# Altium schematic sheet [03] - 28PINS SCHEMATIC.SchDoc (part 3 of 3)
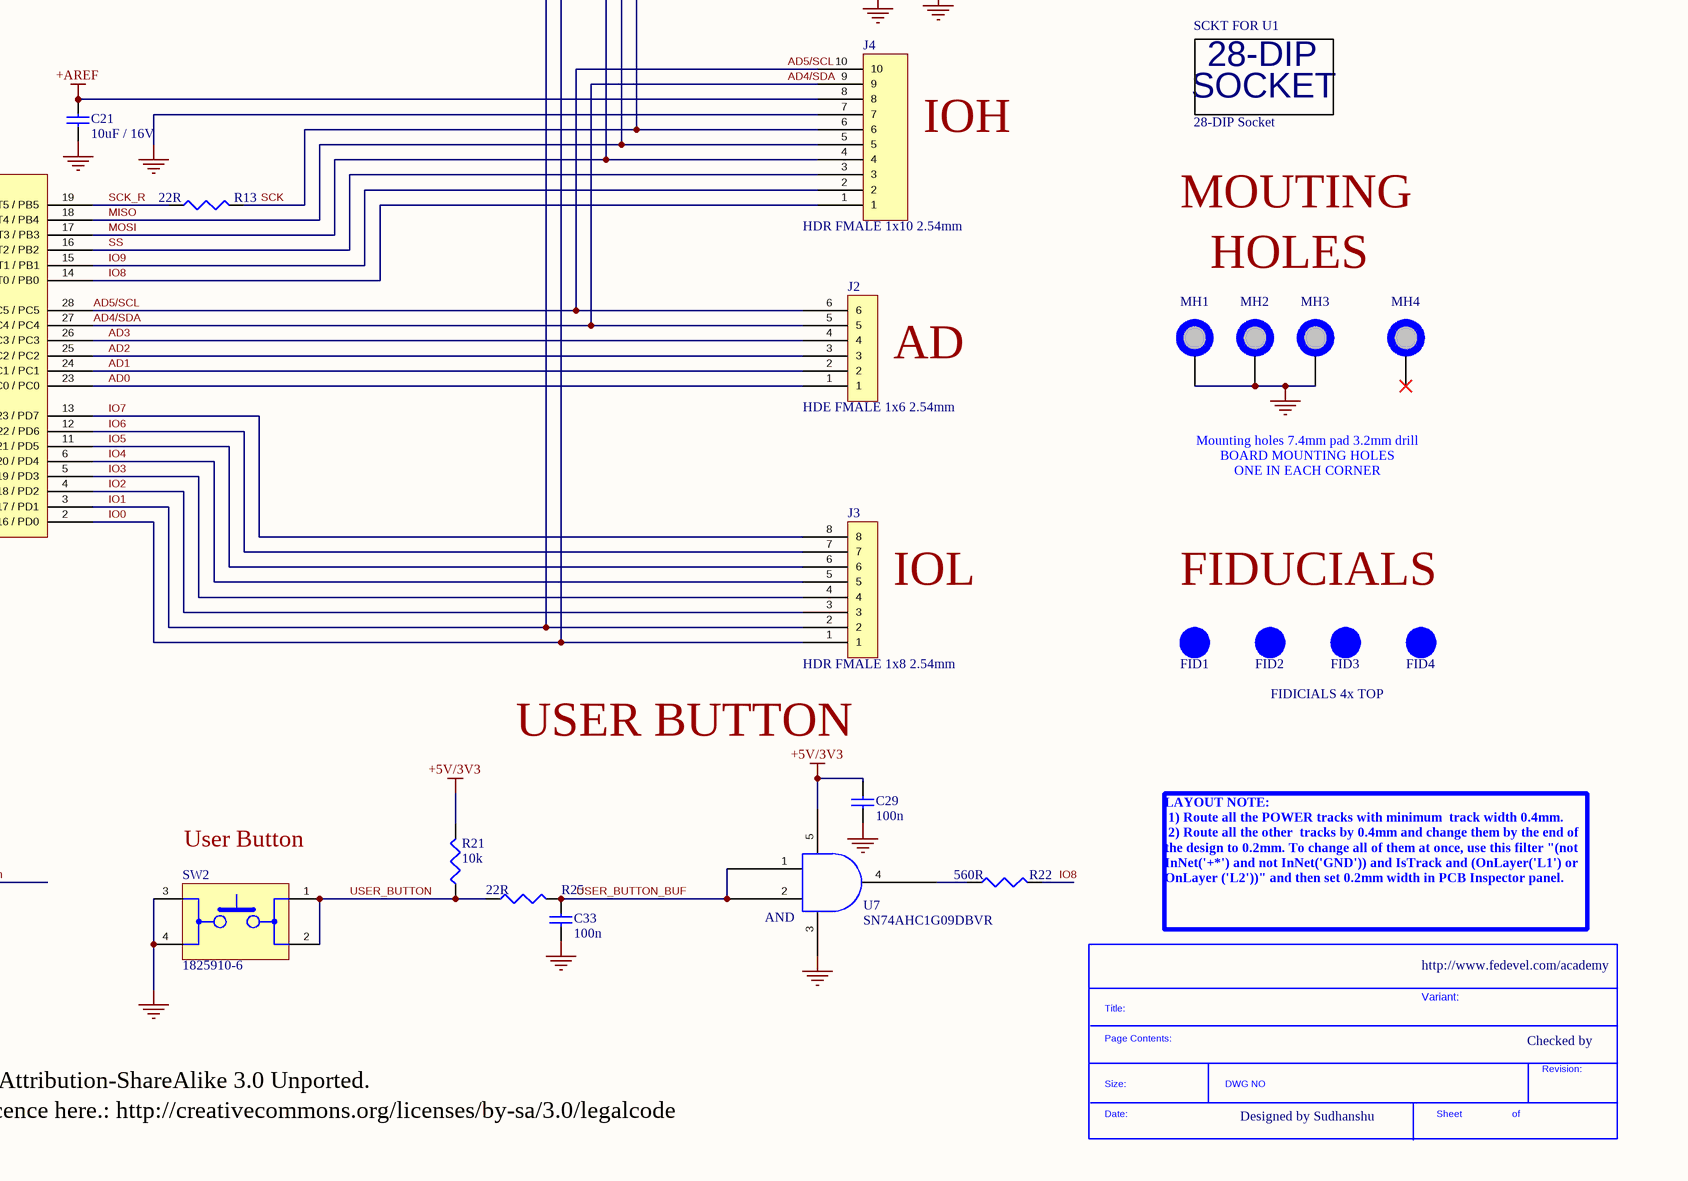
[diagram p5: [03] - 28PINS SCHEMATIC.SchDoc, bottom right]

## Library data of the parts (continued)
U1 = ATMEGA328P-PU: ATMEL         ATMEGA328P-PU            8 Bit Microcontroller, Low Power High Performance, ATmega, 20 MHz, 32 KB, 2 KB, 28 Pins, DIP; Manufacturer: Microchip / Atmel; Core Architecture: AVR; RAM Size: 2KB; Number of PWM Channels: 6; Number of Timers/Counters: 3; Min Supply Voltage: 1.8V; Max Supply Voltage: 5.5V; Interface: I2C,SPI,UART,USART,2-Wire; Number of I/Os: 23; Frequency: 20MHz; Oscillator Type: Internal; Data Bus Width: 8b; Number of SPI Channels: 1; Watchdog Timer: Yes; Memory Type: FLASH; Memory Size: 32KB; Peripherals: Brown-out Detect/Reset,POR,PWM,WDT; Supplier 1: Digi-Key; Manufacturer Part Number: ATMEGA328P-PU; Stock 1: 14212; Pricing 1: 1=2.14, 25=1.9672, 100=1.7819 (USD); Mount: Through Hole; Case/Package: PDIP; Number of Pins: 28; Contact Plating: Tin,Matte; Min Operating Temperature: -40°C; Max Operating Temperature: 85°C; Package Quantity: 14; Number of ADC Channels: 6; Packaging: Rail/Tube; Number of Programmable I/O: 23; Max Frequency: 20MHz; Number of I2C Channels: 1; Length: 37.4mm; Height: 3.28mm; Width: 6.76mm; Radiation Hardening: No; REACH SVHC: No SVHC; Lead Free: Lead Free; ComponentLink1URL: https://datasheet.ciiva.com/1157/1684409-1157696.pdf; ComponentLink1Description: https://datasheet.ciiva.com/1157/1684409-1157696.pdf; ComponentLink2URL: https://datasheet.ciiva.com/20168/73-4283-20168380.pdf; ComponentLink2Description: https://datasheet.ciiva.com/20168/73-4283-20168380.pdf; ComponentLink3URL: https://datasheet.ciiva.com/15213/getdatasheetpartid-318533-15213133.pdf; ComponentLink3Description: https://datasheet.ciiva.com/15213/getdatasheetpartid-318533-15213133.pdf; ComponentLink4URL: https://datasheet.ciiva.com/19457/2139111-19457070.pdf; ComponentLink4Description: https://datasheet.ciiva.com/19457/2139111-19457070.pdf; ComponentLink5URL: https://datasheet.ciiva.com/26818/atmega328p-pu-26818578.pdf; ComponentLink5Description: https://datasheet.ciiva.com/26818/atmega328p-pu-26818578.pdf; ComponentLink6URL: https://datasheet.ciiva.com/29119/155197-da-01-en-microcontr-atmega328p-pu-8bit-pdip-28-29119593.pdf; ComponentLink6Description: https://datasheet.ciiva.com/29119/155197-da-01-en-microcontr-atmega328p-pu-8bit-pdip-28-29119593.pdf; Supplier Part Number 1: ATMEGA328P-PU-ND; Supplier 2: Digi-Key; Stock 2: 4703; Pricing 2: 1=2.52, 25=2.3176, 100=2.1012 (USD); ComponentLink7URL: https://datasheet.ciiva.com/13036/doc7799-28769-13036800.pdf; ComponentLink7Description: https://datasheet.ciiva.com/13036/doc7799-28769-13036800.pdf; ComponentLink8URL: https://datasheet.ciiva.com/22651/doc7799-22651110.pdf; ComponentLink8Description: https://datasheet.ciiva.com/22651/doc7799-22651110.pdf; Supplier 3: Digi-Key; Supplier 4: Digi-Key; Stock 4: 4703; Pricing 4: 1=2.52, 25=2.3176, 100=2.1012 (USD)
U2 = ATMEGA16U2-AU: ATMEL         ATMEGA16U2-AU            MCU, 8BIT, MEGAAVR, 16MHZ, TQFP-32; Manufacturer: Microchip / Atmel; Core Architecture: AVR; Data Bus Width: 8b; RAM Size: 512B; Interface: SPI,Serial,USB,UART,USART; Number of Timers/Counters: 2; Max Supply Voltage: 5.5V; Min Supply Voltage: 2.7V; Number of Programmable I/O: 22; Watchdog Timer: Yes; Memory Type: FLASH; Memory Size: 16KB; Number of PWM Channels: 5; Oscillator Type: Internal; Number of SPI Channels: 1; Peripherals: Brown-out Detect/Reset,POR,PWM,WDT; Supplier 1: Digi-Key; Manufacturer Part Number: ATMEGA16U2-AU; Stock 1: 4703; Pricing 1: 1=2.52, 25=2.3176, 100=2.1012 (USD); Mount: Surface Mount; Case/Package: A; Number of Pins: 32; Contact Plating: Tin,Matte; Min Operating Temperature: -40°C; Max Operating Temperature: 85°C; Package Quantity: 1250; Frequency: 16MHz; Packaging: Tray; Max Frequency: 16MHz; Number of I/Os: 22; Length: 7mm; Height: 1.05mm; Width: 7mm; REACH SVHC: No SVHC; Lead Free: Lead Free; ComponentLink1URL: https://datasheet.ciiva.com/13036/doc7799-28769-13036800.pdf; ComponentLink1Description: https://datasheet.ciiva.com/13036/doc7799-28769-13036800.pdf; ComponentLink2URL: https://datasheet.ciiva.com/22651/doc7799-22651110.pdf; ComponentLink2Description: https://datasheet.ciiva.com/22651/doc7799-22651110.pdf; Supplier Part Number 1: ATMEGA16U2-AU-ND
U3 = TL1963A-33DCQR: IC REG LDO 3.3V 1.5A SOT223-6; Manufacturer: Texas Instruments; Dropout Voltage: 340mV; Number of Outputs: 1; Max Input Voltage: 20V; Min Input Voltage: 2.1V; Min Current Limit: 1.6A; Input Bias Current: 1mA; Polarity: Positive; Accuracy: 3%; Output Type: Fixed; Supplier 1: Digi-Key; Manufacturer Part Number: TL1963A-33DCQR; Stock 1: 0; Pricing 1: 1=2.88, 10=2.589, 100=2.121, 500=1.80554, 1000=1.52275 (USD); Case/Package: SOT-223; Number of Pins: 6; Contact Plating: Gold; Min Operating Temperature: -40°C; Max Operating Temperature: 125°C; Package Quantity: 1; Packaging: Tape and Reel; Output Voltage: 3.3V; Output Current: 1.5A; Max Output Current: 1.5A; Number of Regulators: 1; Quiescent Current: 1mA; Max Output Voltage: 3.3V; Min Output Voltage: 3.3V; Radiation Hardening: No; Lead Free: Lead Free; ComponentLink1URL: https://datasheet.ciiva.com/2046/tl1963a-2046161.pdf; ComponentLink1Description: https://datasheet.ciiva.com/2046/tl1963a-2046161.pdf; ComponentLink2URL: https://datasheet.ciiva.com/2046/tl1963a-2046162.pdf; ComponentLink2Description: https://datasheet.ciiva.com/2046/tl1963a-2046162.pdf; ComponentLink3URL: https://datasheet.ciiva.com/2046/tl1963a-2046163.pdf; ComponentLink3Description: https://datasheet.ciiva.com/2046/tl1963a-2046163.pdf; ComponentLink4URL: https://datasheet.ciiva.com/26176/tl1963a-25-26176569.pdf; ComponentLink4Description: https://datasheet.ciiva.com/26176/tl1963a-25-26176569.pdf; Supplier Part Number 1: 296-24534-1-ND
U4-U7 = SN74AHC1G09DBVR: IC GATE AND 1CH 2-INP SOT-23-5; Manufacturer: Texas Instruments; Min Supply Voltage: 2V; Max Supply Voltage: 5.5V; Quiescent Current: 1uA; Number of Inputs: 2; Propagation Delay: 7.5ns; Output Current: 25mA; Number of Circuits: 1; Low Level Output Current: 8mA; Supplier 1: Digi-Key; Manufacturer Part Number: SN74AHC1G09DBVR; Stock 1: 66145; Pricing 1: 1=0.43, 10=0.32, 100=0.1996, 500=0.13658, 1000=0.10506 (USD); Mount: Surface Mount; Case/Package: SOT-23; Number of Pins: 5; Contact Plating: Tin,Matte; Min Operating Temperature: -55°C; Max Operating Temperature: 125°C; Logic Function: AND; Package Quantity: 3000; Packaging: Tape and Reel; Number of Gates: 1; Number of Elements: 1; Number of Bits: 1; Output Voltage: 5.5V; Number of Outputs: 1; Radiation Hardening: No; REACH SVHC: No SVHC; Lead Free: Lead Free; ComponentLink1URL: https://datasheet.ciiva.com/1864/sn74ahc1g09-1864410.pdf; ComponentLink1Description: https://datasheet.ciiva.com/1864/sn74ahc1g09-1864410.pdf; ComponentLink2URL: https://datasheet.ciiva.com/1864/sn74ahc1g09-1864411.pdf; ComponentLink2Description: https://datasheet.ciiva.com/1864/sn74ahc1g09-1864411.pdf; ComponentLink3URL: https://datasheet.ciiva.com/1864/sn74ahc1g09-1864412.pdf; ComponentLink3Description: https://datasheet.ciiva.com/1864/sn74ahc1g09-1864412.pdf; Supplier Part Number 1: 296-29202-1-ND
Y1 Y2 = ABM7-16.000MHZ-D2Y-T: Crystals 16.0MHz 20ppm 18pF -40C+85C; Manufacturer: Abracon; ESR (Equivalent Series Resistance): 50R; Frequency: 16MHz; Frequency Stability: 30ppm; Supplier 1: Digi-Key; Manufacturer Part Number: ABM7-16.000MHZ-D2Y-T; Stock 1: 67470; Pricing 1: 1=0.72, 10=0.633, 50=0.5912, 100=0.5225, 500=0.495 (USD); Mount: Surface Mount; Case/Package: CSMD; Number of Pins: 2; Min Operating Temperature: -40°C; Max Operating Temperature: 85°C; Frequency Tolerance: 20ppm; Load Capacitance: 18pF; Package Quantity: 1000; Tolerance: 20ppm; Packaging: Tape and Reel; Termination: SMD/SMT; Composition: Ceramic; Length: 6mm; Height: 0.055inch; Width: 3.3mm; Depth: 3.5mm; Radiation Hardening: No; REACH SVHC: Unknown; Lead Free: Lead Free; ComponentLink1URL: https://datasheet.ciiva.com/15116/getdatasheetpartid-721624-15116835.pdf; ComponentLink1Description: https://datasheet.ciiva.com/15116/getdatasheetpartid-721624-15116835.pdf; ComponentLink2URL: https://datasheet.ciiva.com/22658/947971-22658293.pdf; ComponentLink2Description: https://datasheet.ciiva.com/22658/947971-22658293.pdf; ComponentLink3URL: https://datasheet.ciiva.com/5788/abm7-5788054.pdf; ComponentLink3Description: https://datasheet.ciiva.com/5788/abm7-5788054.pdf; ComponentLink4URL: https://datasheet.ciiva.com/16383/abm7-16383174.pdf; ComponentLink4Description: https://datasheet.ciiva.com/16383/abm7-16383174.pdf; ComponentLink5URL: https://datasheet.ciiva.com/7998/947971-7998600.pdf; ComponentLink5Description: https://datasheet.ciiva.com/7998/947971-7998600.pdf; ComponentLink6URL: https://datasheet.ciiva.com/18649/abm7-18649865.pdf; ComponentLink6Description: https://datasheet.ciiva.com/18649/abm7-18649865.pdf; ComponentLink7URL: https://datasheet.ciiva.com/18649/abm7-18649866.pdf; ComponentLink7Description: https://datasheet.ciiva.com/18649/abm7-18649866.pdf; ComponentLink8URL: https://datasheet.ciiva.com/18649/abm7-18649867.pdf; ComponentLink8Description: https://datasheet.ciiva.com/18649/abm7-18649867.pdf; ComponentLink9URL: https://datasheet.ciiva.com/46385/947971-46385243.pdf; ComponentLink9Description: https://datasheet.ciiva.com/46385/947971-46385243.pdf; ComponentLink10URL: https://datasheet.ciiva.com/26941/getdatasheetpartid-719818-26941724.pdf; ComponentLink10Description: https://datasheet.ciiva.com/26941/getdatasheetpartid-719818-26941724.pdf; Supplier Part Number 1: 535-9840-1-ND
Z1 Z2 = CG0603MLC-05E: BOURNS         CG0603MLC-05E            TVS Varistor, AEC-Q200 ChipGuard MLC Series, 8 V, 5 V, 20 V, 0603 [1608 Metric], ESD Protector; Capacitance: 0.5pF; Voltage Rating (DC): 5V; Voltage Rating (AC): 8V; Number of Channels: 1; Clamping Voltage: 20V; Current Rating: 50nA; Turn-On Delay Time: 1ns; Element Configuration: Single; Supplier 1: Digi-Key; Manufacturer: Bourns; Manufacturer Part Number: CG0603MLC-05E; Stock 1: 192911; Pricing 1: 1=0.51, 10=0.359, 25=0.2944, 100=0.2357, 250=0.1714, 500=0.13926, 1000=0.10712, 2500=0.09641 (USD); Case/Package: 0603; Number of Pins: 2; Case Code (Imperial): 0603; Case Code (Metric): 1608; Contact Plating: Tin; Min Operating Temperature: -40°C; Max Operating Temperature: 85°C; Operating Supply Voltage: 5V; Package Quantity: 1; Packaging: Tape and Reel; Termination: SMD/SMT; Voltage: 5V; Number of Circuits: 1; Max Voltage Rating (DC): 5V; Working Voltage: 5V; Leakage Current: 50nA; Length: 1.6mm; Width: 0.8mm; Depth: 0.8mm; Thickness: 0.8mm; Radiation Hardening: No; REACH SVHC: No SVHC; ComponentLink1URL: https://datasheet.ciiva.com/30070/mlc-30070503.pdf; ComponentLink1Description: https://datasheet.ciiva.com/30070/mlc-30070503.pdf; ComponentLink2URL: https://datasheet.ciiva.com/6991/mlc-6991832.pdf; ComponentLink2Description: https://datasheet.ciiva.com/6991/mlc-6991832.pdf; ComponentLink3URL: https://datasheet.ciiva.com/6991/mlc-6991834.pdf; ComponentLink3Description: https://datasheet.ciiva.com/6991/mlc-6991834.pdf; ComponentLink4URL: https://datasheet.ciiva.com/6991/mlc-6991836.pdf; ComponentLink4Description: https://datasheet.ciiva.com/6991/mlc-6991836.pdf; ComponentLink5URL: https://datasheet.ciiva.com/1278/1785244-1278701.pdf; ComponentLink5Description: https://datasheet.ciiva.com/1278/1785244-1278701.pdf; ComponentLink6URL: https://datasheet.ciiva.com/27747/1163231-27747629.pdf; ComponentLink6Description: https://datasheet.ciiva.com/27747/1163231-27747629.pdf; ComponentLink7URL: https://datasheet.ciiva.com/22696/1785244-22696318.pdf; ComponentLink7Description: https://datasheet.ciiva.com/22696/1785244-22696318.pdf; ComponentLink8URL: https://datasheet.ciiva.com/25958/mlc-25958222.pdf; ComponentLink8Description: https://datasheet.ciiva.com/25958/mlc-25958222.pdf; ComponentLink9URL: https://datasheet.ciiva.com/8084/mlc-8084047.pdf; ComponentLink9Description: https://datasheet.ciiva.com/8084/mlc-8084047.pdf; Supplier Part Number 1: CG0603MLC-05ECT-ND